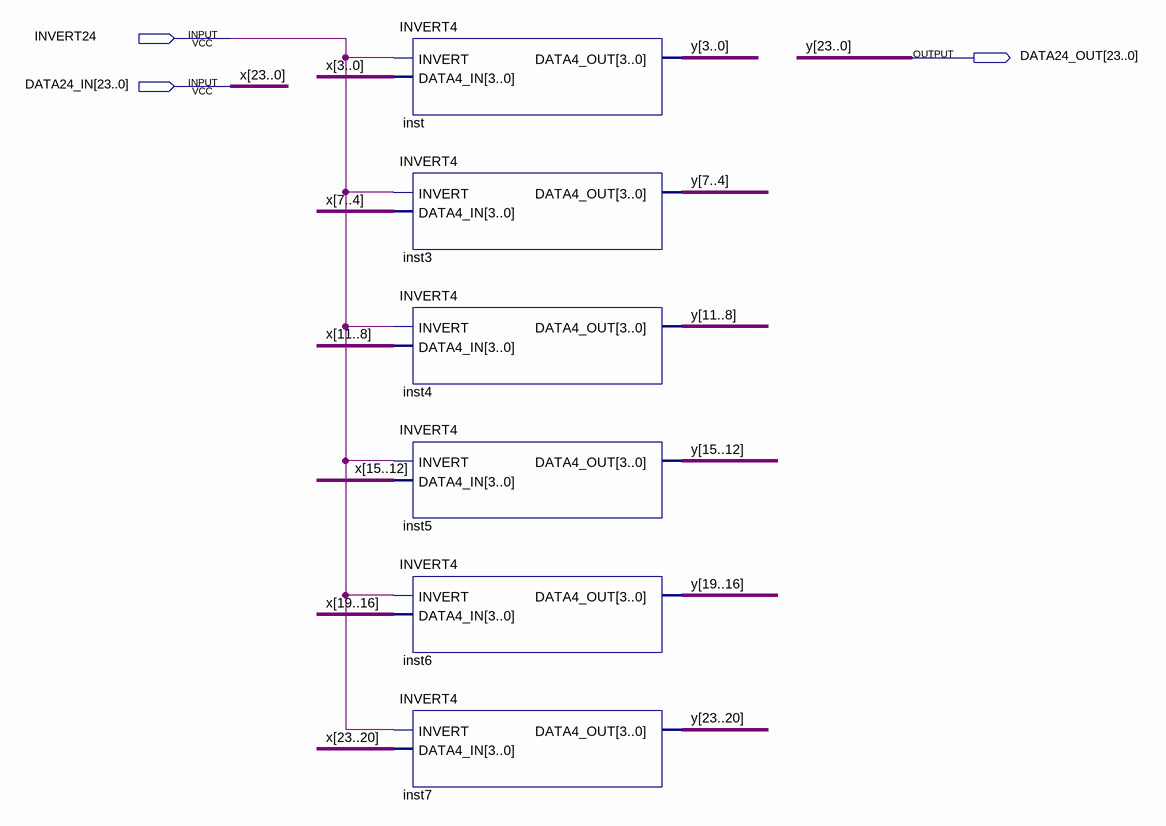
[diagram p0: schematic sheet]
// Quartus schematic INVERT24.bdf as structural Verilog: 6 symbols, 3 pins
module INVERT24 (
  input  INVERT24,
  input  [23:0] DATA24_IN,
  output [23:0] DATA24_OUT
);

  INVERT4 inst (.INVERT(INVERT24), .DATA4_IN(DATA24_IN[3:0]), .DATA4_OUT(DATA24_OUT[3:0]));
  INVERT4 inst3 (.INVERT(INVERT24), .DATA4_IN(DATA24_IN[7:4]), .DATA4_OUT(DATA24_OUT[7:4]));
  INVERT4 inst4 (.INVERT(INVERT24), .DATA4_IN(DATA24_IN[11:8]), .DATA4_OUT(DATA24_OUT[11:8]));
  INVERT4 inst5 (.INVERT(INVERT24), .DATA4_IN(DATA24_IN[15:12]), .DATA4_OUT(DATA24_OUT[15:12]));
  INVERT4 inst6 (.INVERT(INVERT24), .DATA4_IN(DATA24_IN[19:16]), .DATA4_OUT(DATA24_OUT[19:16]));
  INVERT4 inst7 (.INVERT(INVERT24), .DATA4_IN(DATA24_IN[23:20]), .DATA4_OUT(DATA24_OUT[23:20]));

  // Other names for the same wires on the sheet: x[23:0] = DATA24_IN; y[23:0] = DATA24_OUT
endmodule
